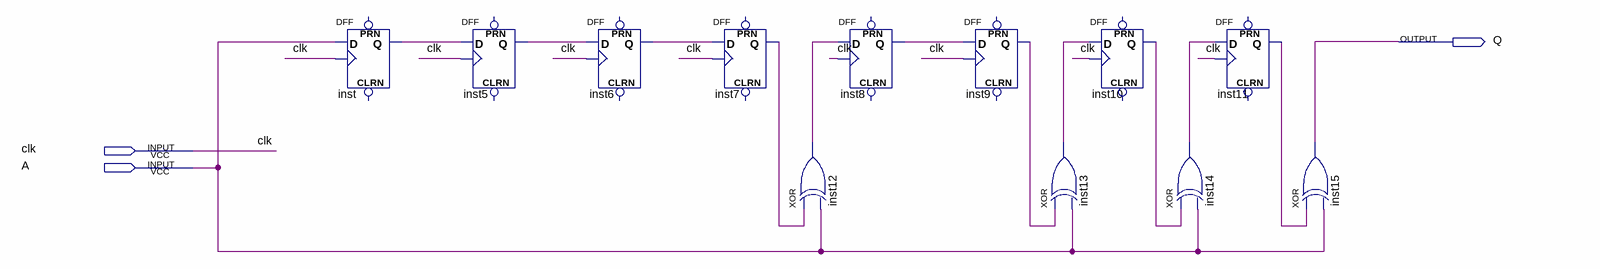
[diagram p0: schematic sheet]
// Quartus schematic Mult.bdf as structural Verilog: 12 symbols, 3 pins
module Mult (
  input  clk,
  input  A,
  output Q
);

  wire inst5_q, inst6_q, inst7_q, inst8_q, inst9_q, inst10_q, inst11_q, inst12_out, inst13_out, inst14_out,
       inst_q;

  DFF inst (.CLK(clk), .D(A), .Q(inst_q));  // open: CLRN, PRN
  DFF inst5 (.CLK(clk), .D(inst_q), .Q(inst5_q));  // open: CLRN, PRN
  DFF inst6 (.CLK(clk), .D(inst5_q), .Q(inst6_q));  // open: CLRN, PRN
  DFF inst7 (.CLK(clk), .D(inst6_q), .Q(inst7_q));  // open: CLRN, PRN
  xor inst12 (inst12_out, inst7_q, A);
  DFF inst8 (.CLK(clk), .D(inst12_out), .Q(inst8_q));  // open: CLRN, PRN
  DFF inst9 (.CLK(clk), .D(inst8_q), .Q(inst9_q));  // open: CLRN, PRN
  xor inst13 (inst13_out, inst9_q, A);
  DFF inst10 (.CLK(clk), .D(inst13_out), .Q(inst10_q));  // open: CLRN, PRN
  DFF inst11 (.CLK(clk), .D(inst14_out), .Q(inst11_q));  // open: CLRN, PRN
  xor inst14 (inst14_out, inst10_q, A);
  xor inst15 (Q, inst11_q, A);
endmodule
